# EAGLE design charlie_chain_v2 (EAGLE 5.11)
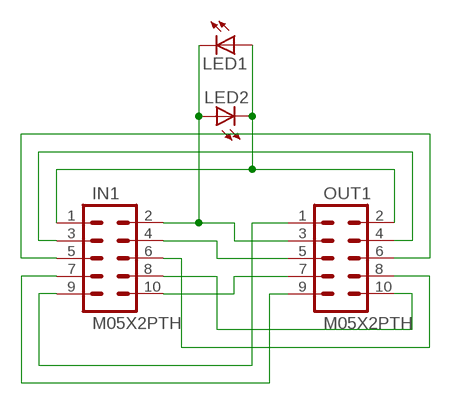
[diagram p0: schematic, sheet 1]

## Parts
IN1  M05X2PTH  [AVR_ICSP]
LED1  LED10MM  [LED10MM]
LED2  LED10MM  [LED10MM]
OUT1  M05X2PTH  [AVR_ICSP]

## Nets
N$1: IN1.1 LED1.A LED2.K(C) OUT1.2
N$2: IN1.2 LED1.K(C) LED2.A OUT1.3
N$5: IN1.3 OUT1.4
N$6: IN1.4 OUT1.5
N$10: IN1.5 OUT1.6
N$11: IN1.6 OUT1.8
N$12: IN1.7 OUT1.9
N$13: IN1.8 OUT1.10
N$14: IN1.9 OUT1.1
N$15: IN1.10 OUT1.7

## Library data of the parts
IN1 OUT1 = SparkFun:M05X2: Header 5x2 Standard 10-pin dual row 0.1" header. Commonly used with AVR-ISP. Use with Spark Fun Electronics SKU: PRT-00778
LED1 LED2 = led:LED: LED OSRAM: - CHIPLED LG R971, LG N971, LY N971, LG Q971, LY Q971, LO R971, LY R971 LH N974, LH R974 LS Q976, LO Q976, LY Q976 LO Q996 - Hyper CHIPLED LW Q18S LB Q993, LB Q99A, LB R99A - SideLED LS A670, LO A670, LY A670, LG A670, LP A670 LB A673, LV A673, LT A673, LW A673 LH A674 LY A675 LS A676, LA A676, LO A676, LY A676, LW A676 LS A679, LY A679, LG A679 - Hyper Micro SIDELED® LS Y876, LA Y876, LO Y876, LY Y876 LT Y87S - SmartLED LW L88C, LW L88S LB L89C, LB L89S, LG L890 LS L89K, LO L89K, LY L89K LS L896, LA L896, LO L896, LY L896 - TOPLED LS T670, LO T670, LY T670, LG T670, LP T670 LSG T670, LSP T670, LSY T670, LOP T670, LYG T670 LG T671, LOG T671, LSG T671 LB T673, LV T673, LT T673, LW T673 LH T674 LS T676, LA T676, LO T676, LY T676, LB T676, LH T676, LSB T676, LW T676 LB T67C, LV T67C, LT T67C, LS T67K, LO T67K, LY T67K, LW E67C LS E67B, LA E67B, LO E67B, LY E67B, LB E67C, LV E67C, LT E67C LW T67C LS T679, LY T679, LG T679 LS T770, LO T770, LY T770, LG T770, LP T770 LB T773, LV T773, LT T773, LW T773 LH T774 LS E675, LA E675, LY E675, LS T675 LS T776, LA T776, LO T776, LY T776, LB T776 LHGB T686 LT T68C, LB T68C - Hyper Mini TOPLED® LB M676 - Mini TOPLED Santana® LG M470 LS M47K, LO M47K, LY M47K Source: http://www.osram.convergy.de LUXEON: - LUMILED® LXK2-PW12-R00, LXK2-PW12-S00, LXK2-PW14-U00, LXK2-PW14-V00 LXK2-PM12-R00, LXK2-PM12-S00, LXK2-PM14-U00 LXK2-PE12-Q00, LXK2-PE12-R00, LXK2-PE12-S00, LXK2-PE14-T00, LXK2-PE14-U00 LXK2-PB12-K00, LXK2-PB12-L00, LXK2-PB12-M00, LXK2-PB14-N00, LXK2-PB14-P00, LXK2-PB14-Q00 LXK2-PR12-L00, LXK2-PR12-M00, LXK2-PR14-Q00, LXK2-PR14-R00 LXK2-PD12-Q00, LXK2-PD12-R00, LXK2-PD12-S00 LXK2-PH12-R00, LXK2-PH12-S00 LXK2-PL12-P00, LXK2-PL12-Q00, LXK2-PL12-R00 Source: www.luxeon.com KINGBRIGHT: KA-3528ASYC Source: www.kingbright.com

## Board
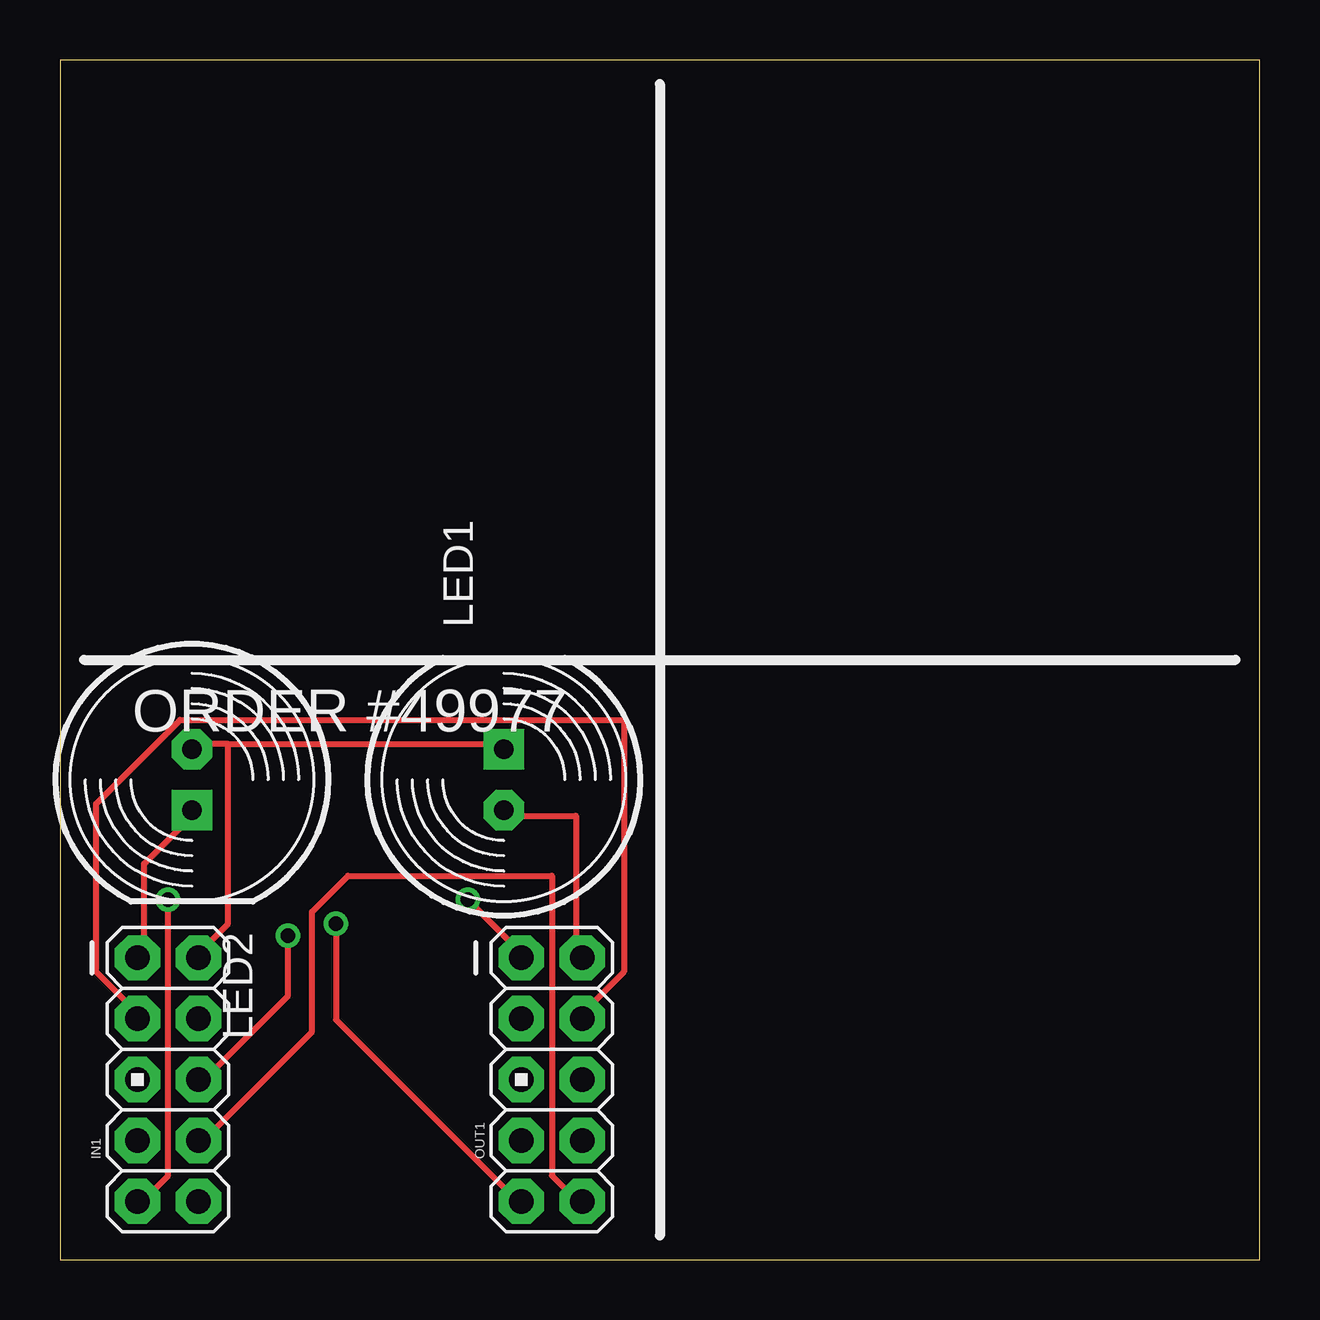
[diagram p1: board, top side]
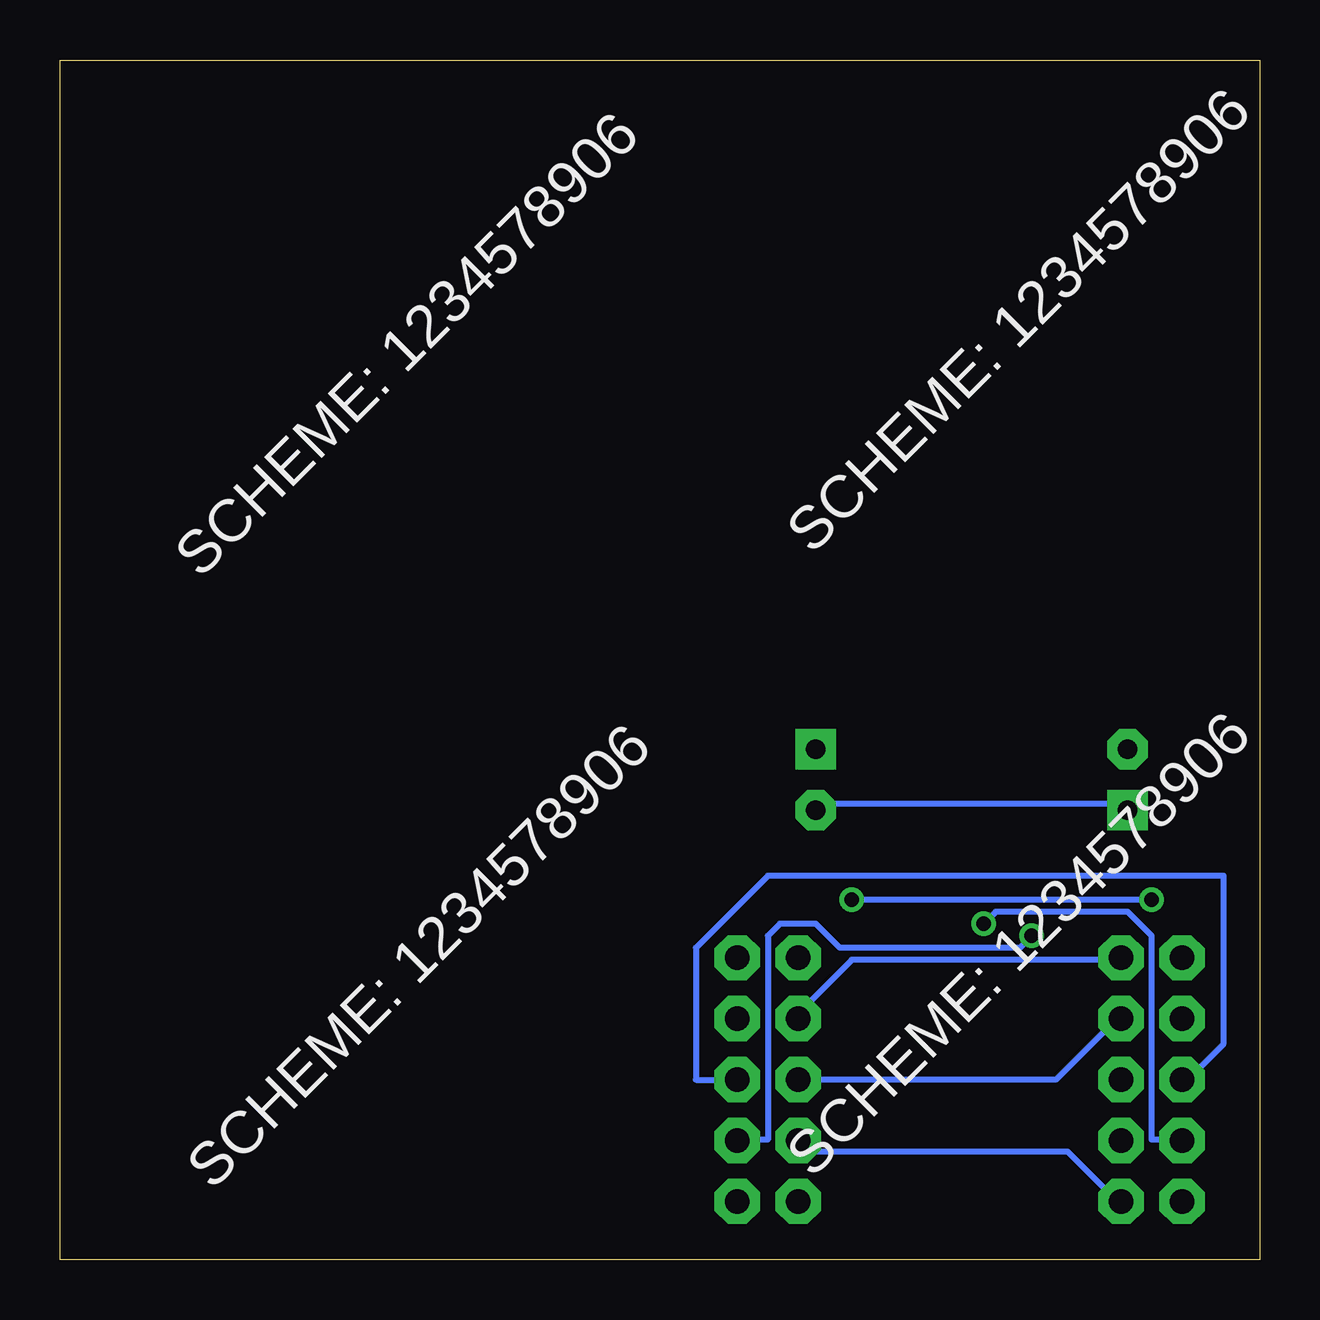
[diagram p2: board, bottom side, seen from below]

Size 50 x 50 mm. Coordinates in mm from the lower left corner, seen from the top.
Outline: 0,0 50,0 50,50 0,50 0,0
Copper layers (1*16): Top 0.035mm / dielectric 1.5mm / Bottom 0.035mm
Design rules "default": minimum track width 10mil, minimum drill 24mil, track to track 8mil, track to pad 8mil, pad to pad 8mil, via to via 8mil, smd to smd 8mil, copper to edge 40mil, drill to drill 8mil, minimum pad ring 10mil, minimum via ring 8mil, stop-mask expansion 4mil, vias tented up to drill 0mil, thermal gap 10mil
tRestrict: area 0,24 to 40,26
bRestrict: area 0,24 to 40,26

### Footprints (pad centres in the part's own frame; a part is rotated, then mirrored left to right if it is on the bottom)
AVR_ICSP = drill 1.016 pad 1.88 octagon: 1 -1.27,5.08; 2 1.27,5.08; 3 -1.27,2.54; 4 1.27,2.54; 5 -1.27,0; 6 1.27,0; 7 -1.27,-2.54; 8 1.27,-2.54; 9 -1.27,-5.08; 10 1.27,-5.08
LED10MM = drill 0.813 pad 1.676 octagon: A -1.27,0 | drill 0.813 pad 1.676 square: K 1.27,0

### Placement (x,y rotation side)
IN1  4.5,7.5 0 top
LED1  18.5,20 90 top
LED2  5.5,20 270 top
OUT1  20.5,7.5 0 top

### Tracks (layer width: path | path; a pad name or v marks a point on that pad's centre or on a via)
N$1
  Top 0.254: LED2.K 5.5,18.5 3.5,16.5 3.5,13 IN1.1 | LED1.A 18.5,18.5 21.5,18.5 21.5,13 OUT1.2
  Bottom 0.254: LED2.K 5.5,19 18.5,19 LED1.A
N$2
  Top 0.254: 7,21.5 18.5,21.5 LED1.K | 7,21.5 5.5,21.5 LED2.A | 7,21.5 7,14 6,13 IN1.2
  Bottom 0.254: OUT1.3 19,10.5 17,12.5 6,12.5 IN1.2
N$5
  Top 0.254: IN1.3 3,10.5 1.5,12 1.5,19 5,22.5 23.5,22.5 23.5,12 22,10.5 OUT1.4
N$6
  Bottom 0.254: IN1.4 6,10 8.5,7.5 OUT1.5
N$10
  Bottom 0.254: IN1.5 3,7.5 1.5,9 1.5,16 20.5,16 23.5,13 23.5,7.5 OUT1.6
N$11  (via drill 0.61)
  Top 0.254: v9.5,13.5 9.5,11 6,7.5 IN1.6
  Bottom 0.254: v9.5,13.5 10,13 17.5,13 18.5,14 20,14 20.5,13.5 20.5,5 21.5,5 OUT1.8
N$12  (via drill 0.61)
  Top 0.254: v11.5,14 11.5,10 19,2.5 OUT1.9
  Bottom 0.254: v11.5,14 11,14.5 5.5,14.5 4.5,13.5 4.5,5 3.5,5 IN1.7
N$13
  Top 0.254: IN1.8 6,5 10.5,9.5 10.5,14.5 12,16 20.5,16 20.5,3.5 21.5,2.5 OUT1.10
N$14  (via drill 0.61)
  Top 0.254: v4.5,15 4.5,3.5 3.5,2.5 IN1.9 | v17,15 19,13 OUT1.1
  Bottom 0.254: v4.5,15 v17,15
N$15
  Bottom 0.254: IN1.10 6,2.5 8,4.5 19,4.5 OUT1.7

### Text on the board
tNames: ORDER #49977
bNames: SCHEME: 1234578906 | SCHEME: 1234578906 | SCHEME: 1234578906 | SCHEME: 1234578906